# EAGLE design SparkFun_TMP102_Qwiic (EAGLE 9.5.0)
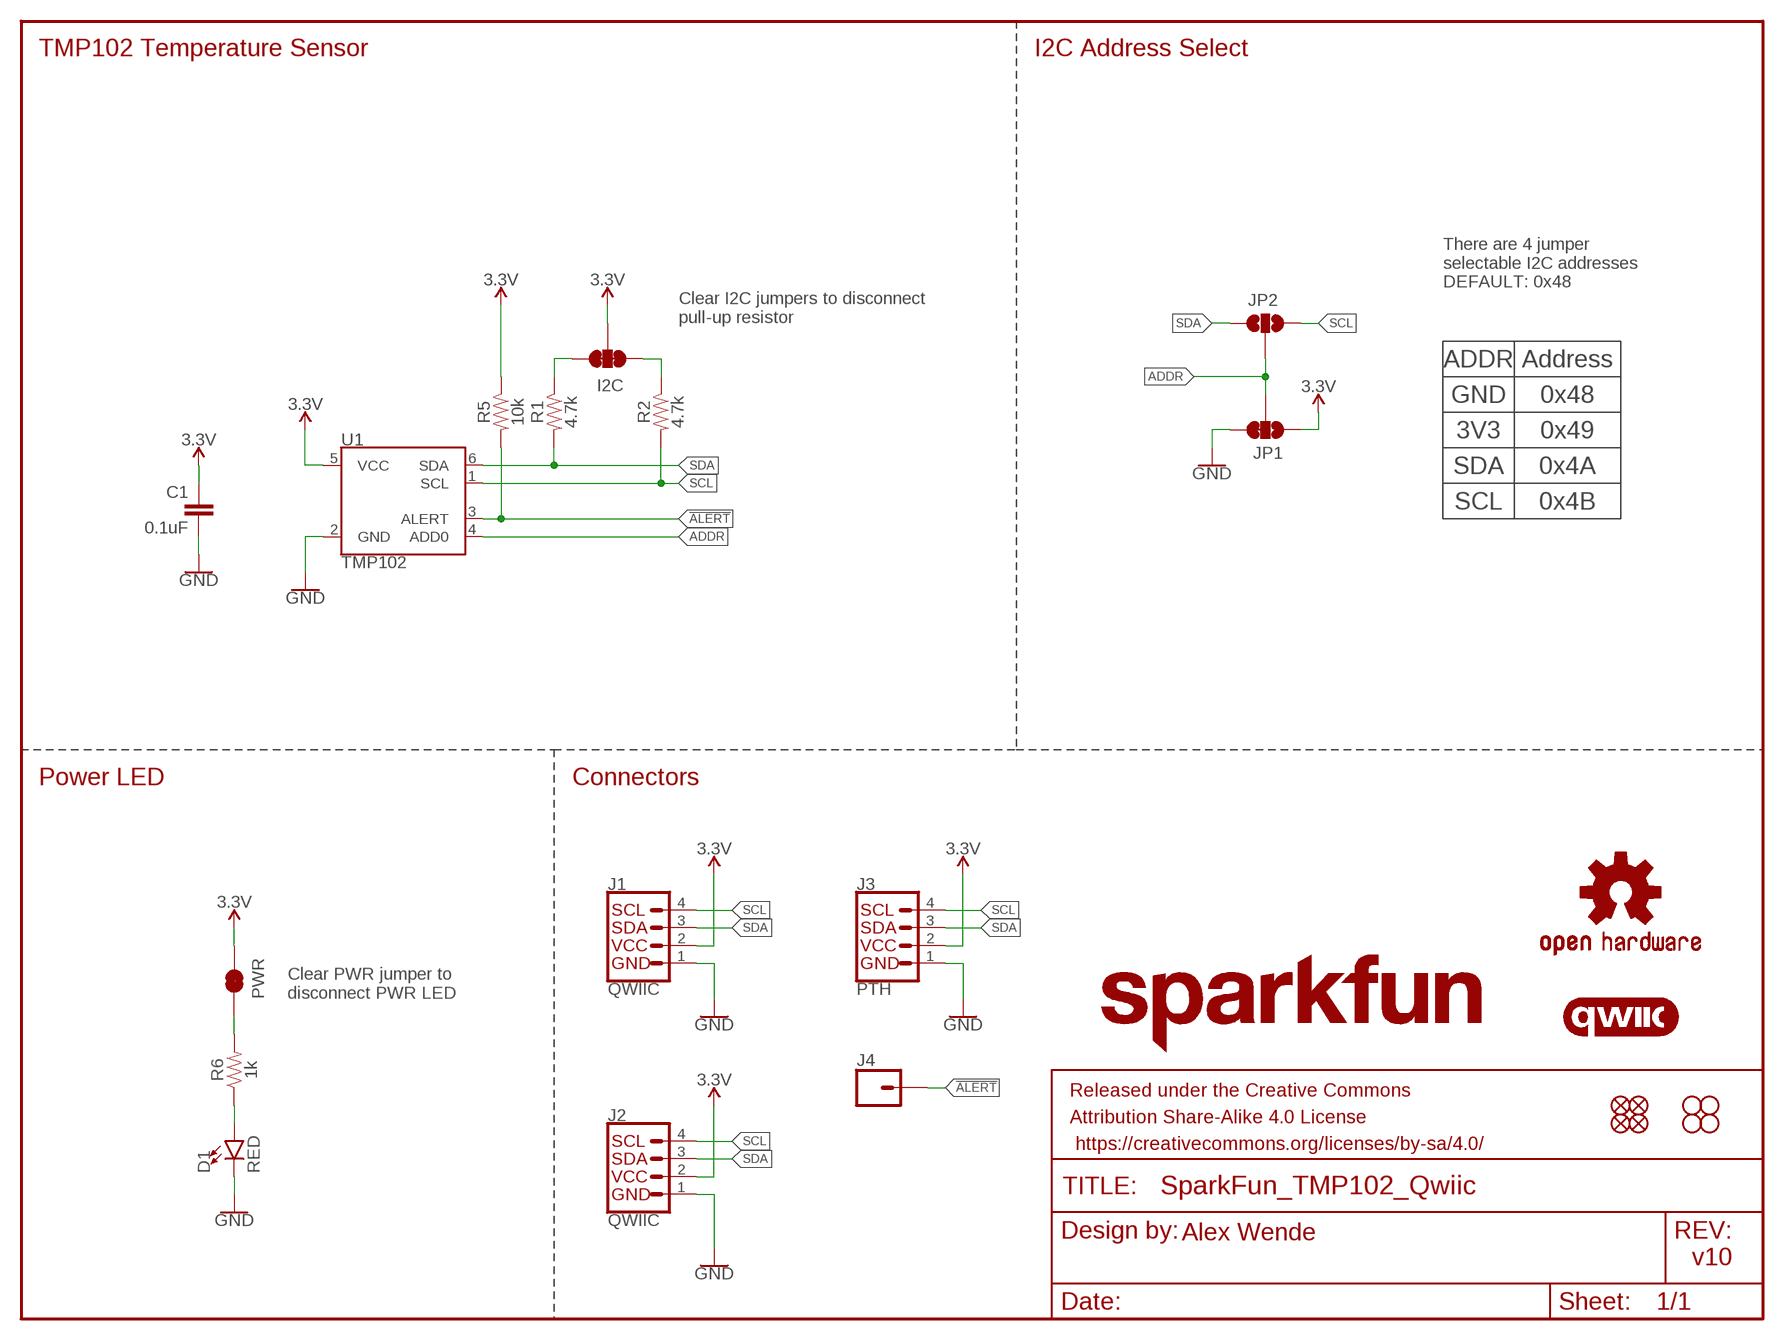
[diagram p0: schematic, sheet 1]

## Parts
C1  0.1uF  0.1UF-0603-25V-(+80/-20%)  [0603]
D1  RED  LED-RED0603  [LED-0603]
FD1  FIDUCIALUFIDUCIAL  [FIDUCIAL-MICRO]
FD2  FIDUCIALUFIDUCIAL  [FIDUCIAL-MICRO]
FD3  FIDUCIALUFIDUCIAL  [FIDUCIAL-MICRO]
FD4  FIDUCIALUFIDUCIAL  [FIDUCIAL-MICRO]
FRAME1  FRAME-LETTER  [CREATIVE_COMMONS]
H1  STAND-OFF  [STAND-OFF]
H2  STAND-OFF  [STAND-OFF]
H3  STAND-OFF  [STAND-OFF]
H4  STAND-OFF  [STAND-OFF]
J1  QWIIC  QWIIC_CONNECTORJS-1MM  [JST04_1MM_RA]
J2  QWIIC  QWIIC_CONNECTORJS-1MM  [JST04_1MM_RA]
J3  PTH  I2C_STANDARD_NO_SILK  [1X04_NO_SILK]
J4  CONN_01PTH_NO_SILK_YES_STOP  [1X01_NO_SILK]
JP1  JUMPER-SMT_3_1-NC_TRACE_NO-SILK  [SMT-JUMPER_3_1-NC_TRACE_NO-SILK]
JP2  JUMPER-SMT_3_NO_NO-SILK  [SMT-JUMPER_3_NO_NO-SILK]
JP3  I2C  JUMPER-SMT_3_2-NC_TRACE_SILK  [SMT-JUMPER_3_2-NC_TRACE_SILK]
JP4  PWR  JUMPER-SMT_2_NC_TRACE_SILK  [SMT-JUMPER_2_NC_TRACE_SILK]
LOGO1  SFE_LOGO_NAME.1_INCH  [SFE_LOGO_NAME_.1]
LOGO2  QWIIC_LOGO_5MM  [QWIIC_5MM]
LOGO3  OSHW-LOGOS  [OSHW-LOGO-S]
R1  4.7k  4.7KOHM-0603-1/10W-1%  [0603]
R2  4.7k  4.7KOHM-0603-1/10W-1%  [0603]
R5  10k  10KOHM-0603-1/10W-1%  [0603]
R6  1k  1KOHM-0603-1/10W-1%  [0603]
U1  TMP102  [SOT563]

## Nets
3.3V: C1.1 J1.2 J2.2 J3.2 JP1.1 JP3.2 JP4.2 R5.1 U1.5(VCC)
!ALERT: J4.1 R5.2 U1.3(ALERT)
ADDR: JP1.2 JP2.2 U1.4(ADD0)
GND: C1.2 D1.C J1.1 J2.1 J3.1 JP1.3 U1.2(GND)
N$13: JP3.3 R1.1
N$14: JP3.1 R2.1
N$20: D1.A R6.1
N$21: JP4.1 R6.2
SCL: J1.4 J2.4 J3.4 JP2.1 R2.2 U1.1(SCL)
SDA: J1.3 J2.3 J3.3 JP2.3 R1.2 U1.6(SDA)

## Notes on the sheet
- TMP102 Temperature Sensor | I2C Address Select
- There are 4 jumper
  selectable I2C addresses
  DEFAULT: 0x48
- Clear I2C jumpers to disconnect
  pull-up resistor
- ADDR | Address
- GND | 0x48
- 3V3 | 0x49
- SDA | 0x4A
- SCL | 0x4B
- Power LED | Connectors
- Clear PWR jumper to
  disconnect PWR LED
- Alex Wende
- v10

## Library data of the parts
C1 = SparkFun-Capacitors:0.1UF: 0.1µF ceramic capacitors A capacitor is a passive two-terminal electrical component used to store electrical energy temporarily in an electric field.; PROD_ID: CAP-00810
D1 = SparkFun-LED:LED-RED: Red SMD LED Used in manufacturing of most products at SparkFun Packages: 0603 - SMD 0603 package [Product Link] <http://docs.avagotech.com/docs/AV02-0551EN> 0603 SMART - SMD 0603 SMART package ( more efficient and expensive)[Product Link] <http://www.osram-os.com/Graphics/XPic2/00077099_0.pdf> 1206 - SMD1206 package [Product Link] <https://www.sparkfun.com/datasheets/DevTools/LilyPad/Q150OVS4.pdff> SparkFun Products: Pro Mini 328 -5V <https://www.sparkfun.com/products/821> RedBoard <https://www.sparkfun.com/products/12757> IOIO-OTG <https://www.sparkfun.com/products/13613>; PROD_ID: DIO-00819
FD1-FD4 = SparkFun-Aesthetics:FIDUCIAL: Fiducial Alignment Points Point-of-reference for pick-and-place machines and other optical instruments.
FRAME1 = SparkFun-Aesthetics:FRAME-LETTER: Schematic Frame - Letter Standard 8.5x11 US Letter frame
H1-H4 = SparkFun-Hardware:STAND-OFF: Stand Off Drill holes for mechanically mounting via screws, standoffs, etc. Note: Use the keepout ring to avoid running the screw head into surrounding components. Variant Overviews STAND-OFF - Mechanical footprint for a #4 phillips button head screw. STAND-OFF-TIGHT - Mechanical footprint for a #4 phillips button head screw, Example SparkFun Products Screw - Phillips Head (1/4", 4-40, 10 pack) <https://www.sparkfun.com/products/10453> (PRT-10453) Screw - Phillips Head (1/2", 4-40, 10 pack) <https://www.sparkfun.com/products/10452> (PRT-10452) Screw - Phillips Head (3/4", 4-40, 10 pack) <https://www.sparkfun.com/products/10451> (PRT-10451) Screw - Phillips Head (1", 4-40, 10 pack) <https://www.sparkfun.com/products/10450> (PRT-10450)
J1 J2 = SparkFun-Connectors:QWIIC_CONNECTOR: SparkFun I2C Standard Qwiic Connector An SMD 1mm pitch JST connector makes it easy and quick (get it? Qwiic?) to connect I2C devices to each other. The Qwiic system <http://www.sparkfun.com/qwiic> enables fast and solderless connection between popular platforms and various sensors and actuators. We carry 200mm <https://www.sparkfun.com/products/14204>, 100mm <https://www.sparkfun.com/products/14205>, 50mm <https://www.sparkfun.com/products/14206>, and breadboard friendly <https://www.sparkfun.com/products/14207> Qwiic cables. We also offer 10 pcs strips <https://www.sparkfun.com/products/14323> the SMD connectors.; PROD_ID: CONN-13694; VALUE: QWIIC_RIGHT_ANGLE
J3 = SparkFun-Connectors:I2C_STANDARD: SparkFun I2C Standard Pinout Header SparkFun has standardized on a pinout for all I2C based sensor breakouts. This pinout allows I2C boards to be plugged directly into the headers on Arduino Uno compatible boards, and to be daisy chained easily. Example SparkFun Products: SparkFun Atmospheric Sensor Breakout - BME280 <https://www.sparkfun.com/products/13676> SparkFun Altitude/Pressure Sensor Breakout - MPL3115A2 <https://www.sparkfun.com/products/11084> SparkFun TOF Range Finder Sensor - VL6180 <https://www.sparkfun.com/products/12785>
J4 = SparkFun-Connectors:CONN_01: Single connection point. Often used as Generic Header-pin footprint for 0.1 inch spaced/style header connections On any of the 0.1 inch spaced packages, you can populate with these: Break Away Headers - Straight <https://www.sparkfun.com/products/116> (PRT-00116) Break Away Male Headers - Right Angle <https://www.sparkfun.com/products/553> (PRT-00553) Female Headers <https://www.sparkfun.com/products/115> (PRT-00115) Break Away Headers - Machine Pin <https://www.sparkfun.com/products/117> (PRT-00117) Break Away Female Headers - Swiss Machine Pin <https://www.sparkfun.com/products/743> (PRT-00743) This device is also useful as a general connection point to wire up your design to another part of your project. Our various solder wires solder well into these plated through hole pads. Hook-Up Wire - Assortment (Stranded, 22 AWG) <https://www.sparkfun.com/products/11375> (PRT-11375) Hook-Up Wire - Assortment (Solid Core, 22 AWG) <https://www.sparkfun.com/products/11367> (PRT-11367) View the entire wire category on our website here <https://www.sparkfun.com/categories/141> Special notes: SMTSO-256-ET is a "flush mount" nut for a 4-40 screw. We mostly use this on specialty testbeds; it is a nice way to connect hardware to your PCB at an adjustable hieght. Also note, the SNAP packages are for using a snappable style connector. We sell a baggie of snaps and they are also used on two LilyPad designs: Snap Assortment - 30 pack (male and female) <https://www.sparkfun.com/products/11347> (DEV-11347) LilyPad Arduino SimpleSnap <https://www.sparkfun.com/products/10941> (DEV-10941) LilyPad SimpleSnap Protoboard <https://www.sparkfun.com/products/10940> (DEV-10940)
JP1 = SparkFun-Jumpers:JUMPER-SMT_3_1-NC_TRACE: Normally closed trace jumper (1 of 2 connections) This jumper has a trace between two pads so it's normally closed (NC). The other connection is normally open (NO). Use a razor knife to open the connection. For best results follow the IPC guidelines for cutting traces: Cutout at least 0.063 mm (0.005 in). Remove all loose material to clean up the cut area. Seal the cut with an approved epoxy. Reapply solder to reclose the connection, or to close the NO connection.
JP2 = SparkFun-Jumpers:JUMPER-SMT_3_NO: Normally open jumper This jumper has three pads in close proximity to each other. Apply solder to close the connection(s).
JP3 = SparkFun-Jumpers:JUMPER-SMT_3_2-NC_TRACE: Normally closed trace jumper (2 of 2 connections) This jumper has a trace between all three pads so they are normally closed (NC). Use a razor knife to open the connection(s). For best results follow the IPC guidelines for cutting traces: Cutout at least 0.063 mm (0.005 in). Remove all loose material to clean up the cut area. Seal the cut with an approved epoxy. Reapply solder to reclose the connection(s).
JP4 = SparkFun-Jumpers:JUMPER-SMT_2_NC_TRACE: Normally closed trace jumper This jumper has a trace between two pads so it's normally closed (NC). Use a razor knife to open the connection. For best results follow the IPC guidelines for cutting traces: Cutout at least 0.063 mm (0.005 in). Remove all loose material to clean up the cut area. Seal the cut with an approved epoxy. Reapply solder to reclose the connection.
LOGO1 = SparkFun-Aesthetics:SFE_LOGO_NAME: SparkFun Font Logo This is the SparkFun name logo. The logo on the schematic will always be the same size; the package variant is the height of the flame part of the logo (or the height the flame would be, if it were drawn). Default layer for the logo on the board is tSilk.
LOGO2 = SparkFun-Aesthetics:QWIIC_LOGO: Qwiic Logos for placement on schematic and PCB. The 5.5mm silk logo is best for placing next to Qwiic connector.
LOGO3 = SparkFun-Aesthetics:OSHW-LOGO: Open-Source Hardware (OSHW) Logo This logo indicates the piece of hardware it is found on incorporates a OSHW license and/or adheres to the definition of open source hardware found here: http://freedomdefined.org/OSHW
R1 R2 = SparkFun-Resistors:4.7KOHM: 4.7kΩ resistor A resistor is a passive two-terminal electrical component that implements electrical resistance as a circuit element. Resistors act to reduce current flow, and, at the same time, act to lower voltage levels within circuits. - Wikipedia; PROD_ID: RES-07857
R5 = SparkFun-Resistors:10KOHM: 10kΩ resistor A resistor is a passive two-terminal electrical component that implements electrical resistance as a circuit element. Resistors act to reduce current flow, and, at the same time, act to lower voltage levels within circuits. - Wikipedia; PROD_ID: RES-00824
R6 = SparkFun-Resistors:1KOHM: 1kΩ resistor A resistor is a passive two-terminal electrical component that implements electrical resistance as a circuit element. Resistors act to reduce current flow, and, at the same time, act to lower voltage levels within circuits. - Wikipedia; PROD_ID: RES-07856
U1 = SparkFun-Sensors:TMP102: Texas Instruments TMP102 Low-Power Digital Temperature Sensor The TMP102 is a digital sensor (I2C a.k.a. TWI), has a resolution of 0.0625°C, and is accurate up to 0.5°C. This is a very handy sensor that requires a very low-current. Datasheet <http://www.sparkfun.com/datasheets/Sensors/Temperature/tmp102.pdf> SparkFun Products SparkFun Digital Temperature Sensor Breakout - TMP102 <https://www.sparkfun.com/products/11931> (SEN-11931); PROD_ID: IC-09303

## Board
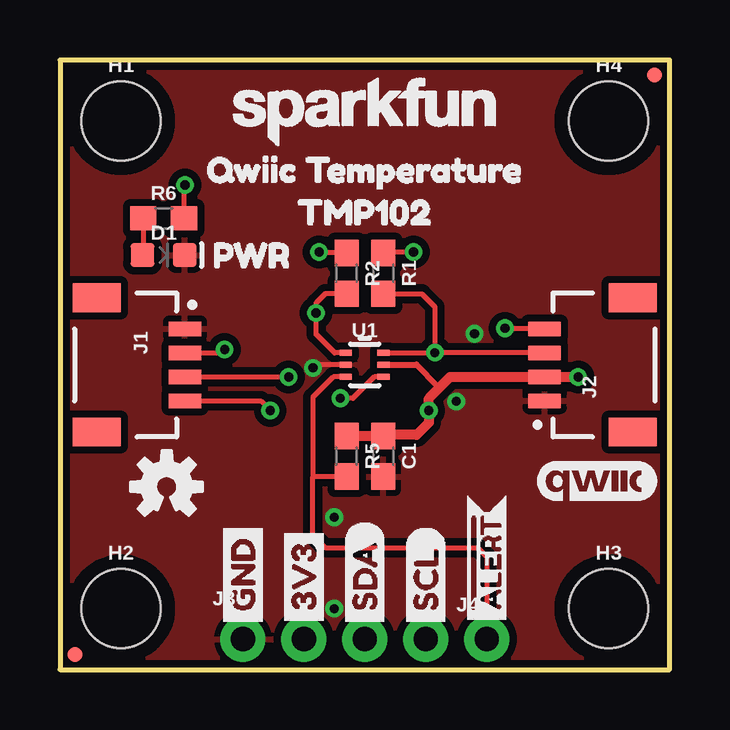
[diagram p1: board, top side]
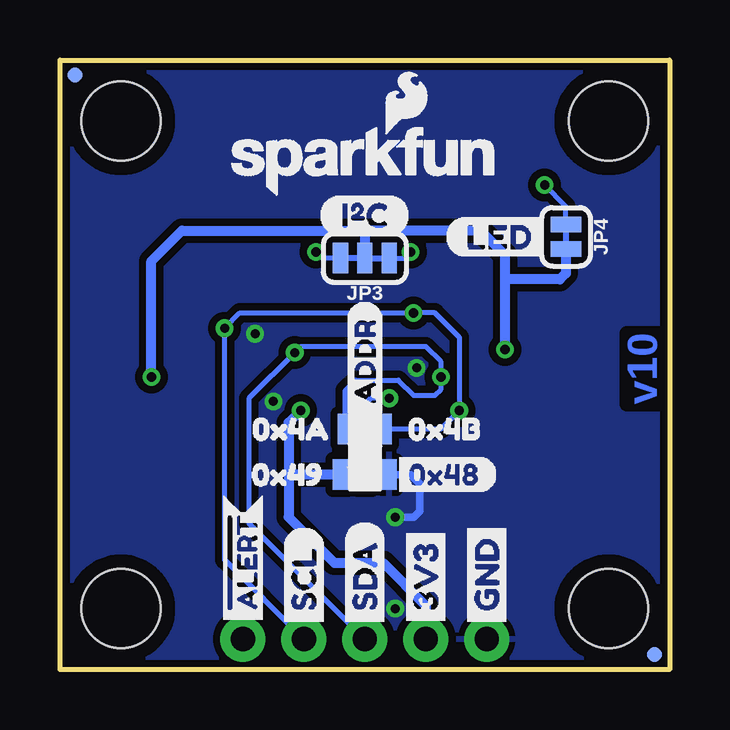
[diagram p2: board, bottom side, seen from below]

Size 25.4 x 25.4 mm. Coordinates in mm from the lower left corner, seen from the top.
Outline: 0,0 25.4,0 25.4,25.4 0,25.4 0,0
Copper layers (1*16): Top 0.035mm / dielectric 1.5mm / Bottom 0.035mm
Design rules "SparkFun-2-layer-TIGHT": minimum track width 7mil, minimum drill 15mil, track to track 7mil, track to pad 7mil, pad to pad 7mil, via to via 7mil, smd to smd 7mil, copper to edge 7mil, drill to drill 7mil, minimum pad ring 7mil, minimum via ring 7mil, stop-mask expansion 4mil, vias tented up to drill 25mil, thermal gap 10mil

### Footprints (pad centres in the part's own frame; a part is rotated, then mirrored left to right if it is on the bottom)
0603 = smd 1.1 x 1: 1 -0.85,0; 2 0.85,0
LED-0603 = smd 1 x 1: A -0.877,0; C 0.877,0
FIDUCIAL-MICRO = smd 0.635 x 0.635: 1 0,0
STAND-OFF = hole 3.302: 0,0
JST04_1MM_RA = smd 0.6 x 1.35: 1 -1.5,0; 2 -0.5,0; 3 0.5,0; 4 1.5,0 | smd 1.2 x 2: NC1 2.8,-3.675; NC2 -2.8,-3.675
1X04_NO_SILK = drill 1.016 pad 1.88: 1 0,0; 2 2.54,0; 3 5.08,0; 4 7.62,0
1X01_NO_SILK = drill 1.016 pad 1.88: 1 0,0
SMT-JUMPER_3_1-NC_TRACE_NO-SILK = smd 0.635 x 1.27: 1 -1.016,0; 2 0,0; 3 1.016,0
SMT-JUMPER_3_NO_NO-SILK = smd 0.635 x 1.27: 1 -0.813,0; 2 0,0; 3 0.813,0
SMT-JUMPER_3_2-NC_TRACE_SILK = smd 0.635 x 1.27: 1 -1.016,0; 2 0,0; 3 1.016,0
SMT-JUMPER_2_NC_TRACE_SILK = smd 0.635 x 1.27: 1 -0.508,0; 2 0.508,0
SOT563 = smd 0.508 x 0.249: 1 -0.8,0.498; 2 -0.8,0.003; 3 -0.8,-0.506; 4 0.776,-0.506; 5 0.776,0.003; 6 0.776,0.498

### Placement (x,y rotation side)
C1  13.46,8.89 270 top
D1  4.32,17.27 0 top
FD1  0.64,0.64 0 top
FD2  0.64,0.64 0 bottom
FD3  24.77,24.77 0 top
FD4  24.77,24.77 0 bottom
FRAME1  -8.89,-24.13 0 top  (outside the outline)
H1  2.54,22.86 0 top
H2  2.54,2.54 0 top
H3  22.86,2.54 0 top
H4  22.86,22.86 0 top
J1  5.21,12.7 270 top
J2  20.19,12.7 90 top
J3  7.62,1.27 0 top
J4  17.78,1.27 0 top
JP1  12.7,8.13 0 bottom
JP2  12.7,10.03 180 bottom
JP3  12.7,17.14 180 bottom
JP4  4.32,18.03 270 bottom
LOGO1  12.7,23.24 0 top
LOGO2  22.35,7.87 0 top
LOGO3  4.45,7.62 0 top
R1  13.46,16.51 270 top
R2  11.94,16.51 270 top
R5  11.94,8.89 270 top
R6  4.32,18.8 0 top
U1  12.7,12.7 0 top
U$1  [#ALERT8]  17.78,1.4 90 top
U$2  [SCL7]  15.24,1.52 90 top
U$3  [SDA6]  12.7,1.52 90 top
U$4  [3V35]  10.16,1.52 90 top
U$5  [GND4]  7.62,1.52 90 top
U$6  [GND4]  7.62,1.52 90 bottom
U$7  [3V35]  10.16,1.52 90 bottom
U$8  [SDA6]  12.7,1.52 90 bottom
U$9  [SCL7]  15.24,1.52 90 bottom
U$10  [#ALERT8]  17.78,1.4 90 bottom
U$11  [ADDR0]  12.7,10.29 90 bottom
U$12  [0X481]  11.68,8.13 0 bottom
U$13  [0X494]  18.21,8.13 0 bottom
U$14  [0X4A2]  18.21,10.03 0 bottom
U$15  [0X4B3]  11.68,10.03 0 bottom
U$16  [I#C0]  14.61,18.92 0 bottom
U$17  [LED0]  9.4,18.03 0 bottom
U$18  [QWIIC_TEMPERATURE0]  5.21,20.83 0 top
U$19  [TMP1022]  9.02,19.05 0 top
U$20  [PWR1]  5.46,17.27 0 top
U$21  [SFE_LOGO_NAME_FLAME_.1]  12.7,21.21 0 bottom

### Tracks (layer width: path | path; a pad name or v marks a point on that pad's centre or on a via)
3.3V  (via drill 0.38)
  Top 0.203: J2.2 | J1.2 6.72,13.2 v6.86,13.34 | C1.1 13.46,9.78 | v21.58,12.2 v21.59,12.19
  Top 0.254: 15.75,11.68 15.75,11.81 14.86,12.7 U1.5
  Top 0.406: R5.1 C1.1 | 13.46,9.78 14.86,9.78 15.37,10.29 v15.37,10.79 15.37,11.3 15.75,11.68 16.26,12.19 J2.2 | J2.2 v21.58,12.2
  Bottom 0.406: 12.7,18.29 JP3.2 | v6.86,13.34 6.86,16.26 | 6.86,16.26 6.86,17.27 7.87,18.29 12.7,18.29 | v21.59,12.19 21.59,17.02 20.32,18.29 12.7,18.29 | J3.2 10.16,2.67 11.94,4.45 13.97,4.45 15.88,6.35 15.88,8.13 | v15.37,10.79 15.88,10.29 15.88,8.13 | JP1.1 15.88,8.13 | JP4.2 4.32,16.51 4.57,16.26 6.86,16.26
!ALERT
  Top 0.203: U1.3 11.39,12.19 10.54,11.34 10.54,8.04 | J4.1 17.78,4.7 17.4,5.08 11.05,5.08 10.54,5.59 10.54,8.04 | R5.2 10.54,8.04
ADDR  (via drill 0.38)
  Top 0.203: U1.4 13.1,12.19 12.2,11.3 v11.68,11.3
  Bottom 0.203: v11.68,11.3 12.45,11.3 12.7,11.05 JP2.2 JP1.2
GND  (via drill 0.38)
  Top 0.203: U1.2 10.76,12.7 10.63,12.57 v10.54,12.57
  Bottom 0.305: JP1.3 10.79,8.13 10.41,7.75 10.41,6.6 10.67,6.35 v11.43,6.35
  other vias: 17.27,14 16.51,11.18 11.43,2.54
  pour Bottom (isolate 0.305): 0,0 25.4,0 25.4,25.4 0,25.4
  pour Top (isolate 0.305): 0,0 25.4,0 25.4,25.4 0,25.4
N$13  (via drill 0.38)
  Top 0.203: v14.73,17.4 13.46,17.4 R1.1
  Bottom 0.203: JP3.3 14.48,17.14 v14.73,17.4
N$14  (via drill 0.38)
  Top 0.203: v10.79,17.4 11.94,17.4 R2.1
  Bottom 0.203: JP3.1 11.05,17.14 v10.79,17.4
N$20
  Top 0.203: D1.A 3.47,17.3 R6.1
N$21  (via drill 0.38)
  Top 0.203: R6.2 5.17,20.15 v5.21,20.19
  Bottom 0.203: JP4.1 4.32,19.3 v5.21,20.19
SCL  (via drill 0.38)
  Top 0.203: U1.1 11.44,13.2 10.67,13.97 v10.67,14.86 10.67,15.28 11.05,15.66 R2.2 | J1.4 8.36,11.2 v8.76,10.79 | J2.4 18.57,14.2 v18.54,14.22
  Bottom 0.203: J3.4 18.54,4.57 v18.54,14.22 17.91,14.86 v10.67,14.86 9.78,14.86 8.76,13.84 v8.76,10.79 9.53,10.03 JP2.1
SDA  (via drill 0.38)
  Top 0.203: R1.2 15.07,15.66 15.62,15.11 v15.62,13.21 | J1.3 9.52,12.2 v9.53,12.19 | J2.3 v15.63,13.2 v15.62,13.21 | U1.6 15.62,13.2 v15.62,13.21
  Bottom 0.203: J3.3 17.53,6.1 17.53,11.3 v15.62,13.21 15.37,13.46 10.16,13.46 9.53,12.83 v9.53,12.19 9.53,11.68 9.78,11.43 10.67,11.43 11.3,12.06 13.08,12.06 13.51,11.63 JP2.3

### Text on the board
Bottom: v10
tDocu: Alex Wende